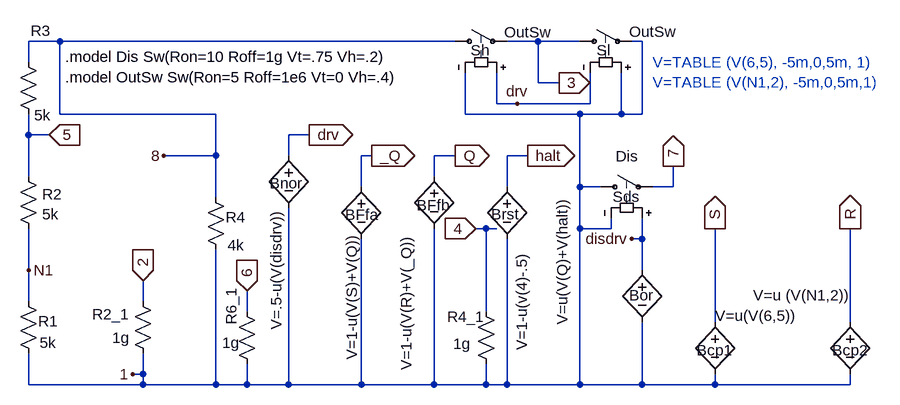
[diagram p0: schematic Lt555Beh.asc]
Lt555Beh.asc, the LTspice schematic file:
Version 4
SHEET 1 1152 916
WIRE -576 128 -576 96
WIRE -576 240 -576 208
WIRE -576 304 -576 240
WIRE -576 448 -576 384
WIRE -576 496 -576 448
WIRE -576 624 -576 576
WIRE -544 240 -576 240
WIRE -528 96 -576 96
WIRE -528 208 -528 96
WIRE -400 496 -400 464
WIRE -400 608 -416 608
WIRE -400 608 -400 576
WIRE -400 624 -576 624
WIRE -400 624 -400 608
WIRE -288 208 -528 208
WIRE -288 272 -368 272
WIRE -288 272 -288 208
WIRE -288 336 -288 272
WIRE -288 624 -400 624
WIRE -288 624 -288 416
WIRE -240 512 -240 480
WIRE -240 624 -288 624
WIRE -240 624 -240 592
WIRE -176 272 -176 240
WIRE -176 624 -240 624
WIRE -176 624 -176 352
WIRE -144 240 -176 240
WIRE -64 320 -64 272
WIRE -64 624 -176 624
WIRE -64 624 -64 400
WIRE -48 272 -64 272
WIRE 48 304 48 272
WIRE 48 624 -64 624
WIRE 48 624 48 384
WIRE 80 96 -528 96
WIRE 80 272 48 272
WIRE 96 208 96 144
WIRE 128 384 112 384
WIRE 128 512 128 384
WIRE 128 624 48 624
WIRE 128 624 128 592
WIRE 144 192 144 144
WIRE 144 384 128 384
WIRE 160 320 160 272
WIRE 160 624 128 624
WIRE 160 624 160 400
WIRE 176 192 144 192
WIRE 192 272 160 272
WIRE 208 96 160 96
WIRE 208 160 208 96
WIRE 240 160 208 160
WIRE 272 96 208 96
WIRE 272 208 96 208
WIRE 272 320 272 208
WIRE 272 384 272 320
WIRE 272 624 160 624
WIRE 272 624 272 384
WIRE 288 192 176 192
WIRE 288 192 288 144
WIRE 304 320 272 320
WIRE 320 384 272 384
WIRE 320 384 320 368
WIRE 336 208 272 208
WIRE 336 208 336 144
WIRE 368 96 352 96
WIRE 368 208 336 208
WIRE 368 208 368 96
WIRE 368 400 352 400
WIRE 368 400 368 368
WIRE 368 448 368 400
WIRE 368 624 272 624
WIRE 368 624 368 528
WIRE 416 320 384 320
WIRE 416 320 416 288
WIRE 480 528 480 384
WIRE 480 624 368 624
WIRE 480 624 480 608
WIRE 688 528 688 384
WIRE 688 624 480 624
WIRE 688 624 688 608
FLAG -576 448 N1
FLAG -544 240 5
IOPIN -544 240 In
FLAG 416 288 7
IOPIN 416 288 Out
FLAG 352 400 disdrv
FLAG -368 272 8
FLAG 240 160 3
IOPIN 240 160 Out
FLAG 176 192 drv
FLAG -416 608 1
FLAG 112 384 4
IOPIN 112 384 In
FLAG -240 480 6
IOPIN -240 480 In
FLAG 480 384 S
IOPIN 480 384 Out
FLAG -400 464 2
IOPIN -400 464 In
FLAG 688 384 R
IOPIN 688 384 Out
FLAG -144 240 drv
IOPIN -144 240 Out
FLAG -48 272 _Q
IOPIN -48 272 Out
FLAG 80 272 Q
IOPIN 80 272 Out
FLAG 192 272 halt
IOPIN 192 272 Out
SYMBOL res -592 480 R0
WINDOW 0 31 47 Left 0
WINDOW 3 33 80 Left 0
SYMATTR InstName R1
SYMATTR Value 5k
SYMBOL res -592 288 R0
WINDOW 0 37 43 Left 0
WINDOW 3 37 74 Left 0
SYMATTR InstName R2
SYMATTR Value 5k
SYMBOL res -592 112 R0
WINDOW 0 19 -32 Left 0
WINDOW 3 25 98 Left 0
SYMATTR InstName R3
SYMATTR Value 5k
SYMBOL sw 288 320 R270
WINDOW 0 -15 35 VRight 0
WINDOW 3 47 39 VRight 0
SYMATTR InstName Sds
SYMATTR Value Dis
SYMBOL sw 64 96 R270
WINDOW 0 -14 40 VRight 0
WINDOW 3 14 92 VRight 0
SYMATTR InstName Sh
SYMATTR Value OutSw
SYMBOL sw 256 96 R270
WINDOW 0 -14 42 VRight 0
WINDOW 3 15 92 VRight 0
SYMATTR InstName Sl
SYMATTR Value OutSw
SYMBOL res -304 320 R0
WINDOW 0 31 47 Left 0
WINDOW 3 34 90 Left 0
SYMATTR InstName R4
SYMATTR Value 4k
SYMBOL res -384 592 R180
WINDOW 0 36 76 Left 0
WINDOW 3 36 40 Left 0
SYMATTR InstName R2_1
SYMATTR Value 1g
SYMBOL bv 480 512 R0
WINDOW 0 -28 59 Left 0
WINDOW 3 126 6 Right 0
SYMATTR InstName Bcp1
SYMATTR Value V=u(V(6,5))
SYMBOL bv 688 512 R0
WINDOW 0 -28 59 Left 0
WINDOW 3 -149 -25 Left 0
SYMATTR InstName Bcp2
SYMATTR Value V=u (V(N1,2))
SYMBOL bv 368 432 R0
WINDOW 0 -20 55 Left 0
WINDOW 3 -123 -96 VRight 0
SYMATTR InstName Bor
SYMATTR Value V=u(V(Q)+V(halt))
SYMBOL bv -176 256 R0
WINDOW 0 -29 58 Left 0
WINDOW 3 -19 99 VRight 0
SYMATTR InstName Bnor
SYMATTR Value V=.5-u(V(disdrv))
SYMBOL bv -64 304 R0
WINDOW 0 -25 59 Left 0
WINDOW 3 -15 87 VRight 0
SYMATTR InstName BFfa
SYMATTR Value V=1-u(V(S)+V(Q))
SYMBOL bv 48 288 R0
WINDOW 0 -27 60 Left 0
WINDOW 3 -43 104 VRight 0
SYMATTR InstName BFfb
SYMATTR Value V=1-u(V(R)+V(_Q))
SYMBOL bv 160 304 R0
WINDOW 0 -24 58 Left 0
WINDOW 3 23 268 VLeft 0
SYMATTR InstName Brst
SYMATTR Value V=1-u(v(4)-.5)
SYMBOL res -256 496 R0
WINDOW 0 -8 -22 VRight 0
WINDOW 3 -22 64 Left 0
SYMATTR InstName R6_1
SYMATTR Value 1g
SYMBOL res 112 496 R0
WINDOW 0 -44 24 Left 0
WINDOW 3 -35 65 Left 0
SYMATTR InstName R4_1
SYMATTR Value 1g
TEXT -520 120 Left 0 !.model Dis Sw(Ron=10 Roff=1g Vt=.75 Vh=.2)\n.model OutSw Sw(Ron=5 Roff=1e6 Vt=0 Vh=.4)
TEXT 384 128 Left 0 ;V=TABLE (V(6,5), -5m,0,5m, 1)\nV=TABLE (V(N1,2), -5m,0,5m,1)

The netlist it stands for:
* Lt555Beh.asc
R1 N1 1 5k
R2 5 N1 5k
R3 8 5 5k
Sds 1 7 disdrv 1 Dis
Sh 8 3 drv 1 OutSw
Sl 3 1 1 drv OutSw
R4 8 1 4k
R2_1 1 2 1g
Bcp1 S 1 V=u(V(6,5))
Bcp2 R 1 V=u (V(N1,2))
Bor disdrv 1 V=u(V(Q)+V(halt))
Bnor drv 1 V=.5-u(V(disdrv))
BFfa _Q 1 V=1-u(V(S)+V(Q))
BFfb Q 1 V=1-u(V(R)+V(_Q))
Brst halt 1 V=1-u(v(4)-.5)
R6_1 6 1 1g
R4_1 4 1 1g
.model Dis Sw(Ron=10 Roff=1g Vt=.75 Vh=.2)
.model OutSw Sw(Ron=5 Roff=1e6 Vt=0 Vh=.4)
* V=TABLE (V(6,5), -5m,0,5m, 1)
* V=TABLE (V(N1,2), -5m,0,5m,1)
.backanno
.end